# EAGLE design module_mh10 (EAGLE 6.3)
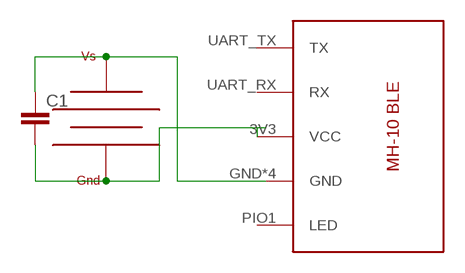
[diagram p0: schematic, sheet 1]

## Parts
C1  C5/2.5  [C5B2.5]
U$1  HM-10  [HM-10]
U$2  CR2032  [CR2032_V]

## Nets
N$3: C1.2 U$2.GND
N$15: U$1.3V3(VCC)
N$18: C1.1 U$2.VSS
Unconnected: U$1.GND U$1.GND2(GND) U$1.GND3(GND) U$1.GND4(GND) U$1.PIO1(LED) U$1.UART_RX(RX) U$1.UART_TX(TX)

## Library data of the parts
C1 = capacitor-wima:C: CAPACITOR naming: grid - package width
U$1 = Kao_lbr:HM-10
U$2 = Kao_lbr:CR2032

## Board
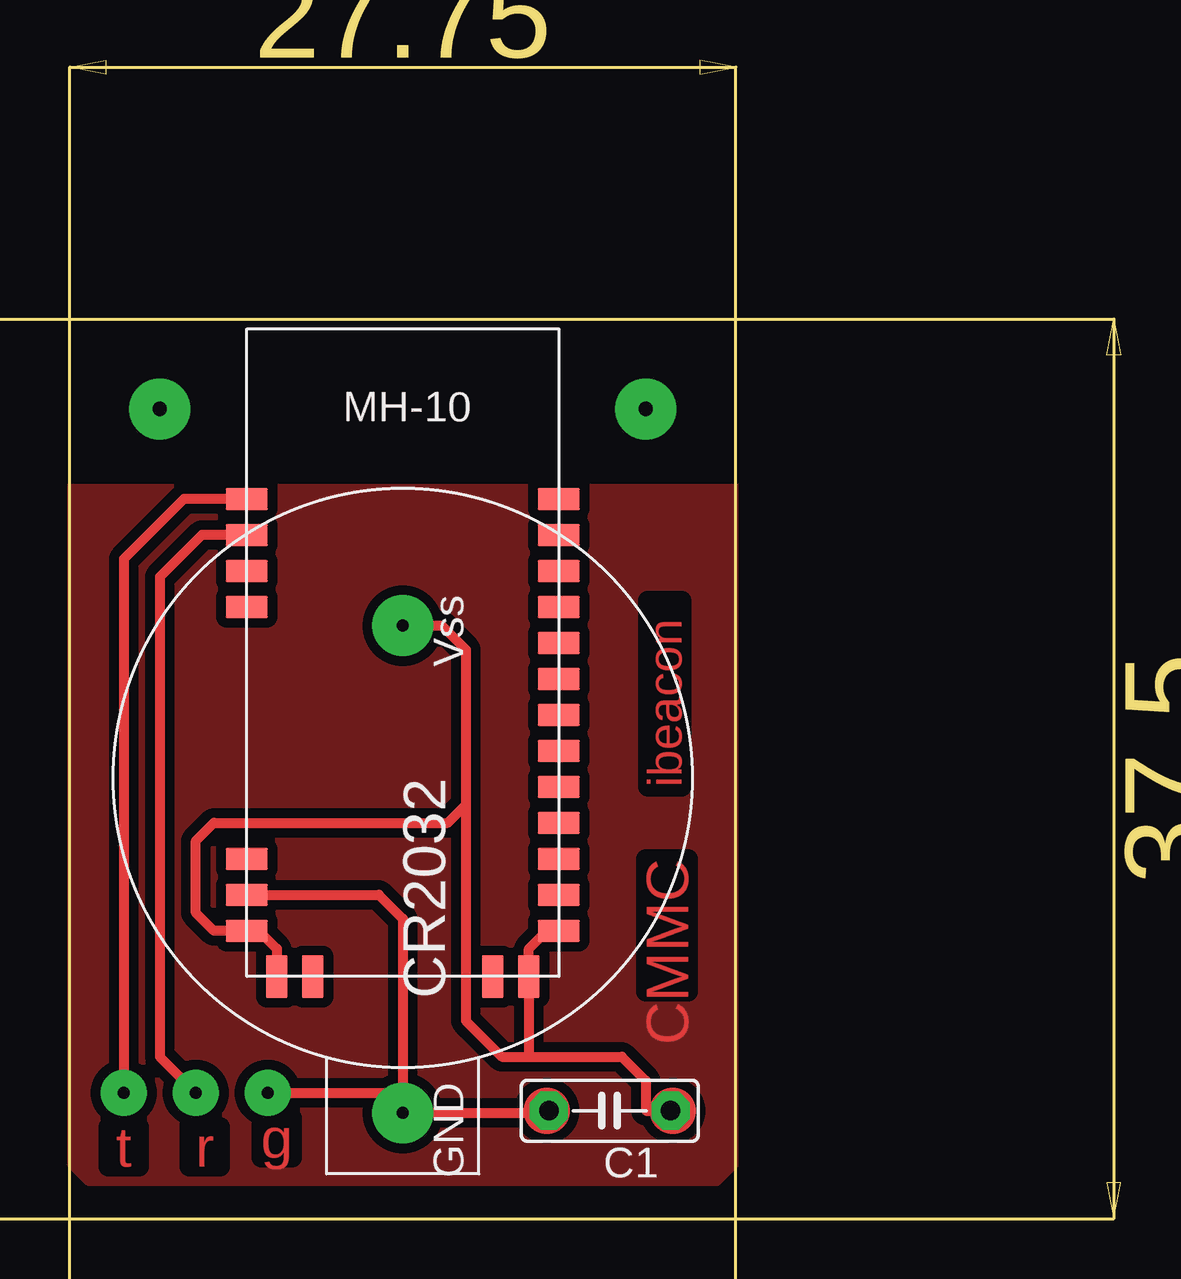
[diagram p1: board, top side]
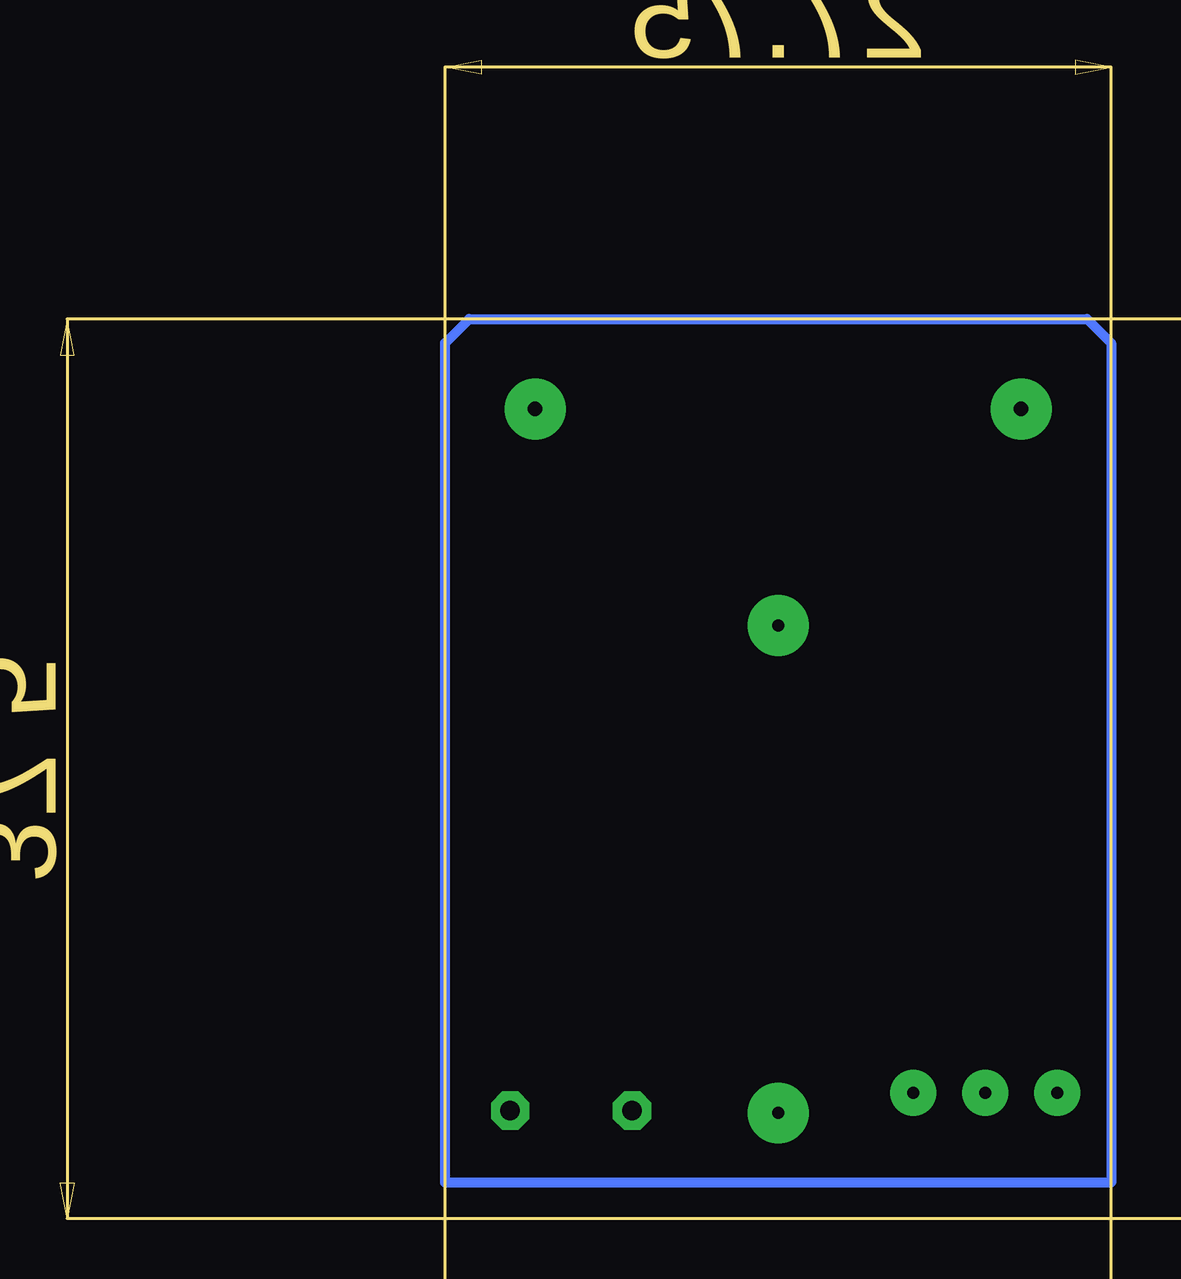
[diagram p2: board, bottom side, seen from below]

Size 43.8 x 48.3 mm. Coordinates in mm from the lower left corner, seen from the top.
Copper layers (1*16): Top 0.035mm / dielectric 1.5mm / Bottom 0.035mm
Design rules "default": minimum track width 10mil, minimum drill 24mil, track to track 8mil, track to pad 8mil, pad to pad 8mil, via to via 8mil, smd to smd 8mil, copper to edge 40mil, drill to drill 8mil, minimum pad ring 10mil, minimum via ring 8mil, stop-mask expansion 4mil, vias tented up to drill 0mil, thermal gap 10mil
Milling: area 43.2,36 to 43.8,37.5; area 43.2,0 to 43.8,1.5; area 43.9,13.3 to 47.4,24.2; area 0,47.7 to 1.5,48.3; area 26.2,47.7 to 27.8,48.3; area 7,48.4 to 20.7,51.9; 6 lines

### Footprints (pad centres in the part's own frame; a part is rotated, then mirrored left to right if it is on the bottom)
C5B2.5 = drill 0.813 pad 1.6 octagon: 1 -2.54,0; 2 2.54,0
HM-10 = smd 1.778 x 0.914: 3V3 -6.5,3.4; GND -6.5,1.9; GND4 6.5,1.9; PIO0 6.5,3.4; PIO1 6.5,4.9; PIO2 6.5,6.4; PIO3 6.5,7.9; PIO4 6.5,9.4; PIO5 6.5,10.9; PIO6 6.5,12.4; PIO7 6.5,13.9; PIO8 6.5,15.4; PIO9 6.5,16.9; PIO10 6.5,18.4; PIO11 6.5,19.9; RESETB -6.5,4.9; UART_CTS -6.5,16.9; UART_RTS -6.5,15.4; UART_RX -6.5,18.4; UART_TX -6.5,19.9 | smd 0.914 x 1.778: GND2 -5.25,0; GND3 5.25,0; USB_D+ 3.75,0; USB_D- -3.75,0
CR2032_V = drill 0.5 pad 2.54: GND 13.97,0; VSS -6.35,0

### Placement (x,y rotation side)
C1  22.5,4.5 180 top
U$1  13.88,10.1 0 top
U$2  13.88,18.38 270 top

### Tracks (layer width: path | path; a pad name or v marks a point on that pad's centre or on a via)
GND  (via drill 0.5 pad 1.93)
  other vias: 2.25,5.25
N$1
  Bottom 0.406: 27.75,1.5 27.75,36.5 26.75,37.5 1,37.5 0,36.5 0,1.5
N$2
  Bottom 0.406: 0,1.5 27.75,1.5
N$3
  Top 0.254: 19.87,4.4 C1.2
  Top 0.406: U$2.GND 19.87,4.4
N$5
  Top 0.406: 6.75,30 4.75,30 2.25,27.5 2.25,6
N$6
  Top 0.406: 6.75,28.5 5.5,28.5 3.75,26.75 3.75,6.75 4.88,5.62
N$8
  Top 0.406: 19.12,10.5 19.12,11.25 19.88,12
N$9
  Top 0.406: 7.88,12 8.62,11.25 8.62,10.5
N$11  (via drill 0.6 pad 2.54)
  other vias: 3.75,33.75
N$12  (via drill 0.6 pad 2.54)
  other vias: 24,33.75
N$13
  pour Top (isolate 0.406): 0.75,37.5 0,36.75 0,2.25 0.75,1.5 27,1.5 27.75,2.25 27.75,36.75 27,37.5
N$14
  cutout Top: 0,30.75 0,36.5 1,37.5 26.75,37.5 27.75,36.5 27.75,30.75
N$16
  Top 0.406: 7.5,13.5 12.88,13.5 13.88,12.5 13.88,5.25
N$18
  Top 0.406: 6.75,12 6,12 5.25,12.75 5.25,15.75 6,16.5 15.75,16.5 16.5,17.25 | U$2.VSS 15.5,24.73 16.5,23.73 16.5,17.25 | 16.5,17.25 16.5,8.25 18,6.75 19.12,6.75 | 19.12,6.75 23,6.75 24,5.75 24,4.5 C1.1 | 19.12,9.75 19.12,6.75
RX  (via drill 0.5 pad 1.93)
  other vias: 5.25,5.25
TX  (via drill 0.5 pad 1.93)
  Top 0.406: v8.25,5.25 13.5,5.25
(copper drawn outside any net)
  shapes: Top circle x2

### Text on the board
Top: ibeacon | CMMC | t | r | g